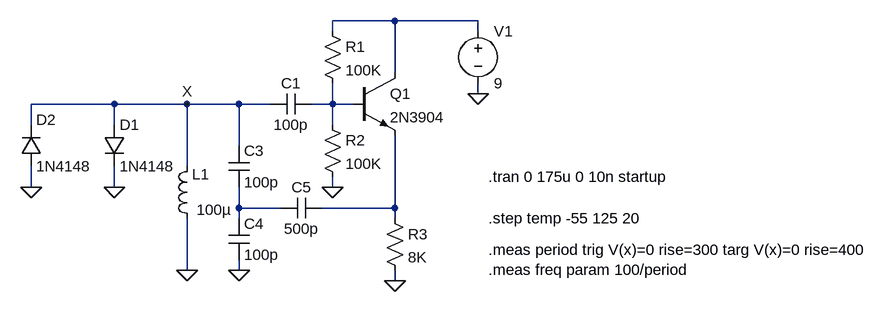
[diagram p0: schematic DotMeasFreq.asc]
DotMeasFreq.asc, the LTspice schematic file:
Version 4
SHEET 1 2344 1936
WIRE 400 1232 304 1232
WIRE 528 1232 400 1232
WIRE 304 1248 304 1232
WIRE 528 1248 528 1232
WIRE 400 1312 400 1232
WIRE 528 1344 528 1328
WIRE -32 1360 -160 1360
WIRE 80 1360 -32 1360
WIRE 160 1360 80 1360
WIRE 208 1360 160 1360
WIRE 304 1360 304 1328
WIRE 304 1360 272 1360
WIRE 336 1360 304 1360
WIRE -160 1392 -160 1360
WIRE -32 1392 -32 1360
WIRE 304 1392 304 1360
WIRE 160 1424 160 1360
WIRE 80 1456 80 1360
WIRE -160 1488 -160 1456
WIRE -32 1488 -32 1456
WIRE 304 1488 304 1472
WIRE 160 1520 160 1488
WIRE 224 1520 160 1520
WIRE 400 1520 400 1408
WIRE 400 1520 288 1520
WIRE 160 1536 160 1520
WIRE 400 1536 400 1520
WIRE 80 1616 80 1536
WIRE 160 1616 160 1600
WIRE 400 1632 400 1616
FLAG 400 1632 0
FLAG 528 1344 0
FLAG 160 1616 0
FLAG 80 1616 0
FLAG -32 1488 0
FLAG -160 1488 0
FLAG 304 1488 0
FLAG 80 1360 X
SYMBOL npn 336 1312 R0
SYMATTR InstName Q1
SYMATTR Value 2N3904
SYMBOL res 384 1520 R0
SYMATTR InstName R3
SYMATTR Value 8K
SYMBOL cap 272 1344 R90
WINDOW 0 0 32 VBottom 0
WINDOW 3 32 32 VTop 0
SYMATTR InstName C1
SYMATTR Value 100p
SYMBOL voltage 528 1232 R0
SYMATTR InstName V1
SYMATTR Value 9
SYMBOL ind 96 1552 R180
WINDOW 0 8 84 Right 0
WINDOW 3 1 29 Right 0
SYMATTR InstName L1
SYMATTR Value 100µ
SYMBOL cap 144 1424 R0
SYMATTR InstName C3
SYMATTR Value 100p
SYMBOL cap 144 1536 R0
SYMATTR InstName C4
SYMATTR Value 100p
SYMBOL cap 288 1504 R90
WINDOW 0 0 32 VBottom 0
WINDOW 3 32 32 VTop 0
SYMATTR InstName C5
SYMATTR Value 500p
SYMBOL diode -48 1392 R0
SYMATTR InstName D1
SYMATTR Value 1N4148
SYMBOL diode -176 1456 M180
WINDOW 0 24 72 Left 0
WINDOW 3 24 0 Left 0
SYMATTR InstName D2
SYMATTR Value 1N4148
SYMBOL res 288 1232 R0
SYMATTR InstName R1
SYMATTR Value 100K
SYMBOL res 288 1376 R0
SYMATTR InstName R2
SYMATTR Value 100K
TEXT 544 1472 Left 0 !.tran 0 175u 0 10n startup
TEXT 544 1584 Left 0 !.meas period trig V(x)=0 rise=300 targ V(x)=0 rise=400\n.meas freq param 100/period
TEXT 544 1536 Left 0 !.step temp -55 125 20

The netlist it stands for:
* DotMeasFreq.asc
Q1 N001 N002 N004 0 2N3904
R3 N004 0 8K
C1 N002 X 100p
V1 N001 0 9
L1 0 X 100µ
C3 X N003 100p
C4 N003 0 100p
C5 N004 N003 500p
D1 X 0 1N4148
D2 0 X 1N4148
R1 N001 N002 100K
R2 N002 0 100K
.model D D
.lib standard.dio
.model NPN NPN
.model PNP PNP
.lib standard.bjt
.tran 0 175u 0 10n startup
.meas period trig V(x)=0 rise=300 targ V(x)=0 rise=400
.meas freq param 100/period
.step temp -55 125 20
.backanno
.end